# EasyEDA Pro project 桌面排烟扇.eprj

# Schematic Schematic1
Board Name: Board1; Create Date: 2025-06-08; Page Name: P1; Project Name: 桌面排烟扇; Schematic Name: Schematic1; Update Date: 2025-06-08; Add into BOM: yes; Company: 嘉立创EDA; Convert to PCB: yes; Page Size: A4; Version: V1.0
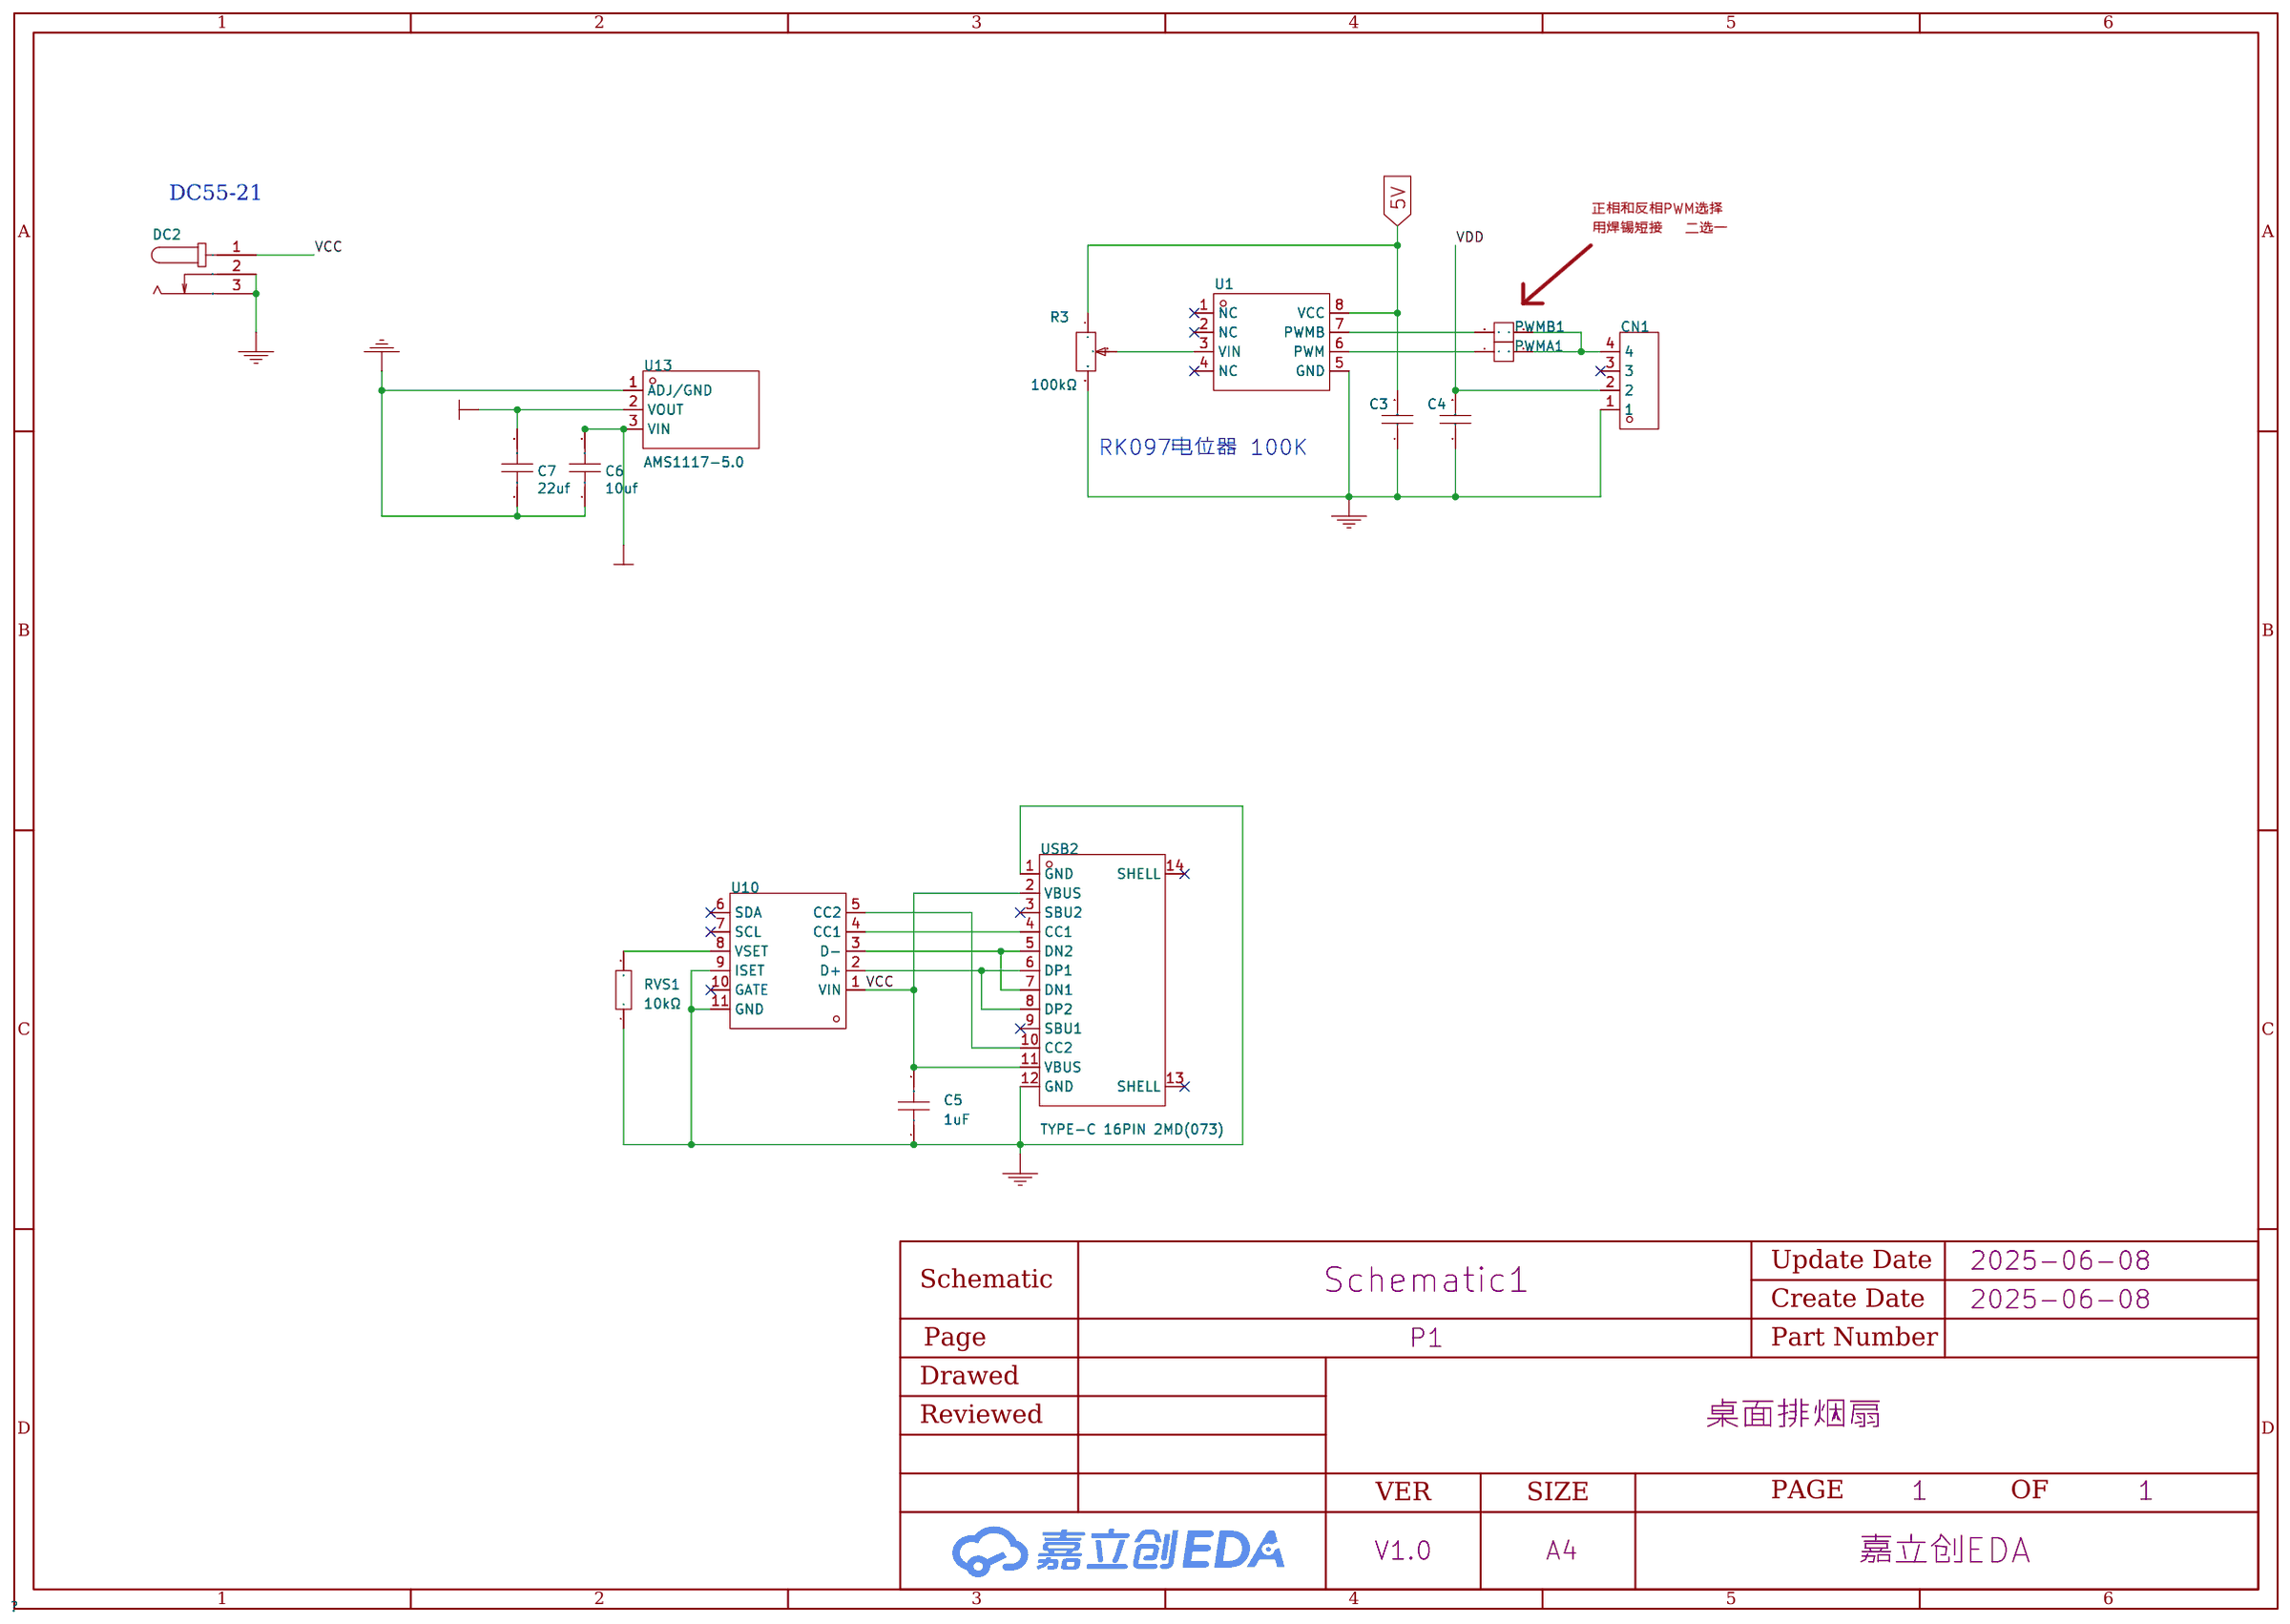
[diagram p0: schematic sheet]

## Parts
C3  10uF  [C0603]
C4  10uF  [C0603]
C5  1uF  [C0603]
C6  10uf  [C0603]
C7  22uf  [C0603]
CN1  KF2510-4AGW-GW  [CONN-TH_4P-P2.54_CAX_KF2510-4AGW-GW]
DC2  -  [DC-IN-TH_KH-DC-005-2.5]
PWMA1  -  [cs]
PWMB1  -  [cs]
R3  100kΩ  [res-adj-th_rk097111080j]
RVS1  10kΩ  [R0603]
U1  GP9101-F20K-L2H1-SW  [SOP-8_L5.0-W3.9-P1.27-LS6.0-BL]
U10  HUSB238-002D  [TDFN-10_L3.0-W3.0-P0.50-BL-EP]
U13  AMS1117-5.0  [SOT-89-3_L4.5-W2.5-P1.50-LS4.2-BR]
USB2  TYPE-C 16PIN 2MD(073)  [USB-C-SMD_TYPE-C-6PIN-2MD-073]

## Library data of the parts
C3 C4 = GRM188R6YA106MA73D: 容值:10uF;精度:±20%;额定电压:35V;材质(温度系数):-;; LCSC Part Name: 10uF ±20% 35V; Supplier Part: C194427; Manufacturer: muRata(村田); Supplier Footprint: 0603; JLCPCB Part Class: Extended Part; Datasheet: https://atta.szlcsc.com/upload/public/pdf/source/20210128/C194427_FCA3640823207DDB58700A82F1A19B5F.pdf; Supplier: LCSC; Tolerance: ±20%; Voltage Rated: 35V
C5 = CL10A105KL8NNNC: 容值:1uF;精度:±10%;额定电压:35V;材质(温度系数):-;; LCSC Part Name: 1uF ±10% 35V; Supplier Part: C478859; Manufacturer: SAMSUNG(三星); Supplier Footprint: 0603; JLCPCB Part Class: 扩展库; Datasheet: https://atta.szlcsc.com/upload/public/pdf/source/20200102/C478859_0EBF0387113597ECF4C91C52A34CAFD4.pdf; Supplier: LCSC; Tolerance: ±10%; Voltage Rated: 35V
C6 = 10uf
C7 = 22uf
CN1 = KF2510-4AGW-GW: 参考系列:-;间距:2.54mm;插针结构:1x4P;排数:1;每排PIN数:4;行距:-;公母:公型插针;安装方式:弯插;额定电流:3A;工作温度范围:-25℃~+85℃;; LCSC Part Name: 2.54mm 1x4P 弯插; Supplier Part: C722747; Manufacturer: CAX(创都); Supplier Footprint: 弯插,P=2.54mm; JLCPCB Part Class: 扩展库; Datasheet: https://atta.szlcsc.com/upload/public/pdf/source/20200903/C722719_349FB032BA69A16250788D6DAC1BEE3A.pdf; Supplier: LCSC; Pitch: 2.54mm; Pins Structure: 1x4P; Number of Rows: 1; Number of PINs Per Row: 4; Gender: 公型插针; Mounting Style: 弯插; Current Rating (Max): 3A; Operating Temperature Range: -25℃~+85℃
DC2 = KH-DC-005-2.5: 连接器类型:DC电源插座;安装方式:弯插;触点内径:-;触点外径:6.4mm;额定电流:1A;额定电压:30V;工作温度范围:-25~+70;; LCSC Part Name: DC电源插座 外径:6.4mm; Supplier Part: C2847170; Manufacturer: kinghelm(金航标); Supplier Footprint: 插件; JLCPCB Part Class: Extended Part; Datasheet: https://atta.szlcsc.com/upload/public/pdf/source/20210716/C2847170_7F0110A0BEDEE81C68B76DF87AC8DA16.pdf; Supplier: LCSC; Connector Type: DC电源插座; Mounting Style: 弯插; Outside Contact Diameter: 6.4mm; Current Rating (Max): 1A; Voltage Rating (Max): 30V; Operating Temperature Range: -25~+70
PWMA1 PWMB1 = cs
R3 = RK097111080J: Resistance: 100k; Datasheet: https://item.szlcsc.com/datasheet/RK097111080J/98652.html?spm=sc.gbn.xds.a___sc.gbn.hd.ss&lcsc_vid=QVgIA1xXQVVcVlVeQlVdUl0EElkKA1EEElNfVVIFRlkxVlNSTlJaUFNTRFZXVjsOAxUeFF5JWBIBSRccGwIdBEoFGAxBAAgJFQACSQwSGg0%3D
RVS1 = 0603WAF1002T5E: 电阻类型:厚膜电阻;阻值:10kΩ;精度:±1%;功率:100mW;; LCSC Part Name: 厚膜电阻 10kΩ ±1% 100mW; Supplier Part: C25804; Manufacturer: UNI-ROYAL(厚声); Supplier Footprint: 0603; JLCPCB Part Class: 基础库; Datasheet: https://atta.szlcsc.com/upload/public/pdf/source/20200306/C422600_1E6D84923E4A46A82E41ADD87F860B5C.pdf; Supplier: LCSC; Type: 厚膜电阻; Tolerance: ±1%; Power(Watts): 100mW; Temperature Coefficient: ±100ppm/℃; Overload Voltage (Max): 75V; Operating Temperature Range: -55℃~+155℃
U1 = GP9101-F20K-L2H1-SW: GP9101 0-VCC转PWM 20KHz L2H1; LCSC Part Name: 模拟信号转PWM信号; Supplier Part: C2837710; Manufacturer: Guestgood(客益); Supplier Footprint: SOP8; JLCPCB Part Class: 扩展库; Datasheet: https://atta.szlcsc.com/upload/public/pdf/source/20210611/C2837710_B55E2012AD9BA99B0BFF632E52DE3359.pdf; Supplier: LCSC
U10 = HUSB238-002D: Supplier Part: C2765038; JLCPCB Part Class: 扩展库; Supplier: LCSC
U13 = AMS1117-5.0: Supplier Part: C880753; Manufacturer: Slkor(萨科微); Supplier Footprint: SOT-89; JLCPCB Part Class: Extended Part; Datasheet: https://atta.szlcsc.com/upload/public/pdf/source/20190906/C426566_95BE246DE70C248781207323626ADB09.pdf; Supplier: LCSC
USB2 = TYPE-C 16PIN 2MD(073): 连接器类型:Type-C;标准:USB 3.1;公母:母;安装方式:卧贴;触点数量:16P;端口数量:1;额定电流 - 电源:5A;工作温度范围:-25℃~+85℃;; LCSC Part Name: Type-C 母 卧贴; Supplier Part: C2765186; Manufacturer: SHOU HAN(首韩); Supplier Footprint: SMD; JLCPCB Part Class: Extended Part; Datasheet: https://atta.szlcsc.com/upload/public/pdf/source/20211123/39B17C16241EAC15C5E277BDA434118E.pdf; Supplier: LCSC; Connector Type: Type-C; Standard: USB 3.1; Gender: 母; Mounting Style: 卧贴; Number of Contacts: 16P; Number of Ports: 1; Current Rating - Power (Max): 5A; Operating Temperature Range: -25℃~+85℃; Rated Voltage (Max): 5V; Connect-Disconnect Life: 5千次; Core Colour: 黑色

## Nets
5V: C3.2 C7.2 R3.1 U1.8(VCC) U13.2(VOUT)
GND: C3.1 C4.1 C5.1 C6.1 C7.1 CN1.1 DC2.2 DC2.3 R3.3 RVS1.1 U1.5(GND) U10.9(ISET) U10.11(GND) U13.1(ADJ/GND) USB2.1(GND) USB2.12(GND)
VCC: C5.2 DC2.1 U10.1(VIN) USB2.2(VBUS) USB2.11(VBUS)
VDD: C4.2 C6.2 CN1.2 U13.3(VIN)
$1N740: R3.2 U1.3(VIN)
$1N747: RVS1.2 U10.8(VSET)
$1N750: PWMA1.1 U1.6(PWM)
$1N751: PWMB1.1 U1.7(PWMB)
$1N752: CN1.4 PWMA1.2 PWMB1.2
$1N1674: U10.4(CC1) USB2.4(CC1)
$1N1681: U10.2(D+) USB2.6(DP1) USB2.8(DP2)
$1N1699: U10.3(D-) USB2.5(DN2) USB2.7(DN1)
$1N1759: U10.5(CC2) USB2.10(CC2)

Not connected (* = marked no-connect by the designer): CN1 3*; U1 1(NC)* 2(NC)* 4(NC)*; U10 6(SDA)* 7(SCL)* 10(GATE)*; USB2 3(SBU2)* 9(SBU1)* 13(SHELL)* 14(SHELL)*

## Notes on the sheet
- DC55-21
- 正相和反相PWM选择
- 用焊锡短接   二选一
- RK097电位器 100K

# Schematic Schematic2
Board Name: NE55; Create Date: 2025-09-05; Page Name: P1; Project Name: 桌面排烟扇; Schematic Name: Schematic2; Update Date: 2025-09-05; Add into BOM: yes; Company: 嘉立创EDA; Convert to PCB: yes; Page Size: A4; Version: V1.0
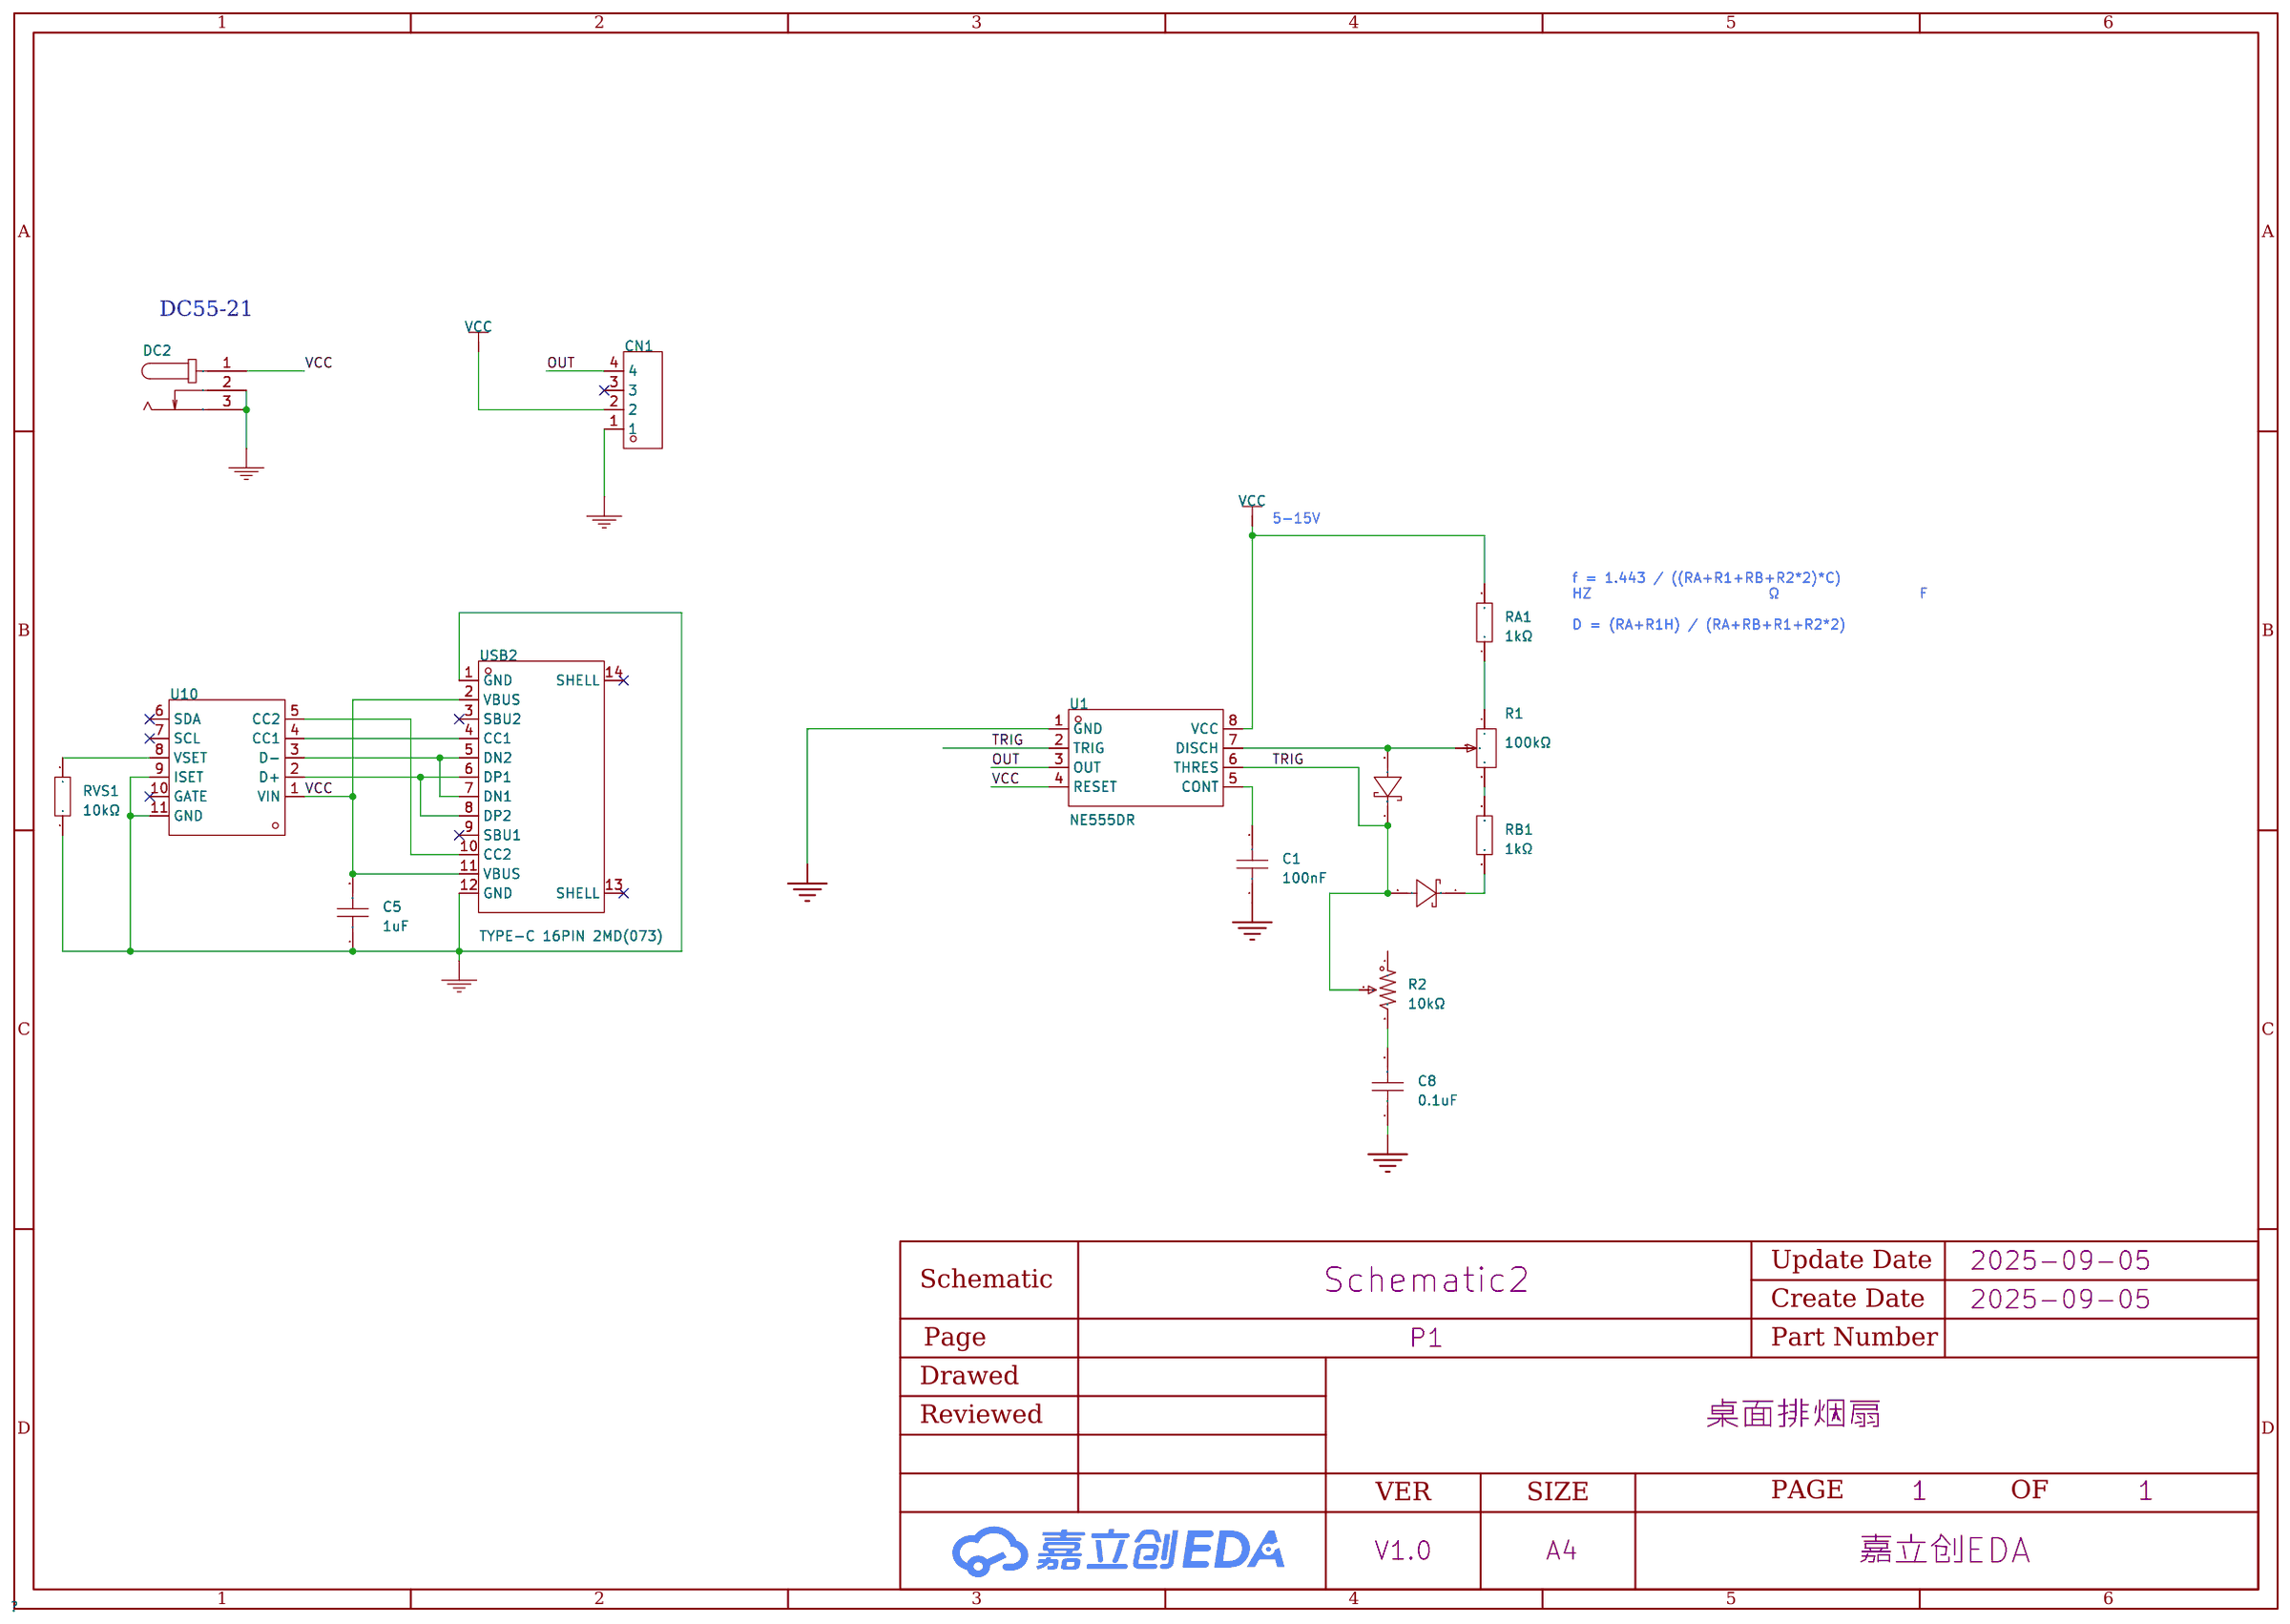
[diagram p1: schematic sheet]

## Parts
C1  100nF  [C0603]
C5  1uF  [C0603]
C8  0.1uF  [C0603]
CN1  KF2510-4AGW-GW  [CONN-TH_4P-P2.54_CAX_KF2510-4AGW-GW]
DC2  -  [DC-IN-TH_KH-DC-005-2.5]
R1  100kΩ  [res-adj-th_rk097111080j]
R2  10kΩ  [RES-ADJ-TH_3P-L10.0-W10.0-P2.50-L]
RA1  1kΩ  [R0603]
RB1  1kΩ  [R0603]
RVS1  10kΩ  [R0603]
U1  NE555DR  [SOP-8_L5.0-W4.0-P1.27-LS6.0-BL]
U2  MBR0520W B2  [SOD-123_L2.7-W1.7-LS3.8-RD]
U3  MBR0520W B2  [SOD-123_L2.7-W1.7-LS3.8-RD]
U10  HUSB238-002D  [TDFN-10_L3.0-W3.0-P0.50-BL-EP]
USB2  TYPE-C 16PIN 2MD(073)  [USB-C-SMD_TYPE-C-6PIN-2MD-073]

## Library data of the parts
C1 = CC0603KRX7R9BB104: 容值:100nF;精度:±10%;额定电压:50V;温度系数:X7R;; LCSC Part Name: 100nF ±10% 50V; Supplier Part: C14663; Manufacturer: YAGEO(国巨); Supplier Footprint: 0603; JLCPCB Part Class: Basic Part; Datasheet: https://atta.szlcsc.com/upload/public/pdf/source/20180910/C282072_33301C7F631E79921B82A8DAC6BCC5B3.pdf; Supplier: LCSC; Tolerance: ±10%; Voltage Rating: 50V; Temperature Coefficient: X7R
C5 = CL10A105KL8NNNC: 容值:1uF;精度:±10%;额定电压:35V;材质(温度系数):-;; LCSC Part Name: 1uF ±10% 35V; Supplier Part: C478859; Manufacturer: SAMSUNG(三星); Supplier Footprint: 0603; JLCPCB Part Class: 扩展库; Datasheet: https://atta.szlcsc.com/upload/public/pdf/source/20200102/C478859_0EBF0387113597ECF4C91C52A34CAFD4.pdf; Supplier: LCSC; Tolerance: ±10%; Voltage Rated: 35V
C8 = CL10A105KB8NNNC: 容值:1uF;精度:±10%;额定电压:50V;材质(温度系数):X5R;; LCSC Part Name: 1uF ±10% 50V; Supplier Part: C15849; Manufacturer: SAMSUNG(三星); Supplier Footprint: 0603; JLCPCB Part Class: Basic Part; Datasheet: https://atta.szlcsc.com/upload/public/pdf/source/20160218/1457707763339.pdf; Supplier: LCSC; Tolerance: ±10%; Voltage Rated: 50V; Temperature Coefficient: X5R
CN1 = KF2510-4AGW-GW: 参考系列:-;间距:2.54mm;插针结构:1x4P;排数:1;每排PIN数:4;行距:-;公母:公型插针;安装方式:弯插;额定电流:3A;工作温度范围:-25℃~+85℃;; LCSC Part Name: 2.54mm 1x4P 弯插; Supplier Part: C722747; Manufacturer: CAX(创都); Supplier Footprint: 弯插,P=2.54mm; JLCPCB Part Class: 扩展库; Datasheet: https://atta.szlcsc.com/upload/public/pdf/source/20200903/C722719_349FB032BA69A16250788D6DAC1BEE3A.pdf; Supplier: LCSC; Pitch: 2.54mm; Pins Structure: 1x4P; Number of Rows: 1; Number of PINs Per Row: 4; Gender: 公型插针; Mounting Style: 弯插; Current Rating (Max): 3A; Operating Temperature Range: -25℃~+85℃
DC2 = KH-DC-005-2.5: 连接器类型:DC电源插座;安装方式:弯插;触点内径:-;触点外径:6.4mm;额定电流:1A;额定电压:30V;工作温度范围:-25~+70;; LCSC Part Name: DC电源插座 外径:6.4mm; Supplier Part: C2847170; Manufacturer: kinghelm(金航标); Supplier Footprint: 插件; JLCPCB Part Class: Extended Part; Datasheet: https://atta.szlcsc.com/upload/public/pdf/source/20210716/C2847170_7F0110A0BEDEE81C68B76DF87AC8DA16.pdf; Supplier: LCSC; Connector Type: DC电源插座; Mounting Style: 弯插; Outside Contact Diameter: 6.4mm; Current Rating (Max): 1A; Voltage Rating (Max): 30V; Operating Temperature Range: -25~+70
R1 = RK097111080J: Resistance: 100k; Datasheet: https://item.szlcsc.com/datasheet/RK097111080J/98652.html?spm=sc.gbn.xds.a___sc.gbn.hd.ss&lcsc_vid=QVgIA1xXQVVcVlVeQlVdUl0EElkKA1EEElNfVVIFRlkxVlNSTlJaUFNTRFZXVjsOAxUeFF5JWBIBSRccGwIdBEoFGAxBAAgJFQACSQwSGg0%3D
R2 = 3296W-1-103: 阻值:10kΩ;精度:±10%;; LCSC Part Name: 10kΩ ±10%; Supplier Part: C118954; Manufacturer: BOCHEN(博晨); Supplier Footprint: 插件; JLCPCB Part Class: 扩展库; Datasheet: https://atta.szlcsc.com/upload/public/pdf/source/20171114/C118954_15106326646611117443.pdf; Supplier: LCSC; Tolerance: ±10%
RA1 RB1 = 0603WAF1002T5E: 电阻类型:厚膜电阻;阻值:10kΩ;精度:±1%;功率:100mW;; LCSC Part Name: 厚膜电阻 10kΩ ±1% 100mW; Supplier Part: C25804; Manufacturer: UNI-ROYAL(厚声); Supplier Footprint: 0603; JLCPCB Part Class: 基础库; Datasheet: https://atta.szlcsc.com/upload/public/pdf/source/20200306/C422600_1E6D84923E4A46A82E41ADD87F860B5C.pdf; Supplier: LCSC; Type: 厚膜电阻; Tolerance: ±1%; Power(Watts): 100mW; Temperature Coefficient: ±100ppm/℃; Overload Voltage (Max): 75V; Operating Temperature Range: -55℃~+155℃; Voltage-Supply(Max): 75V; Operating Temperature: -55℃~+155℃
RVS1 = 0603WAF1002T5E: 电阻类型:厚膜电阻;阻值:10kΩ;精度:±1%;功率:100mW;; LCSC Part Name: 厚膜电阻 10kΩ ±1% 100mW; Supplier Part: C25804; Manufacturer: UNI-ROYAL(厚声); Supplier Footprint: 0603; JLCPCB Part Class: 基础库; Datasheet: https://atta.szlcsc.com/upload/public/pdf/source/20200306/C422600_1E6D84923E4A46A82E41ADD87F860B5C.pdf; Supplier: LCSC; Type: 厚膜电阻; Tolerance: ±1%; Power(Watts): 100mW; Temperature Coefficient: ±100ppm/℃; Overload Voltage (Max): 75V; Operating Temperature Range: -55℃~+155℃
U1 = NE555DR: Supplier Part: C695838; Manufacturer: UMW(友台半导体); Supplier Footprint: SOP-8; JLCPCB Part Class: 扩展库; Datasheet: https://atta.szlcsc.com/upload/public/pdf/source/20231109/10F1BB7F0C3DC760A85BC3699079301C.pdf; Supplier: LCSC
U2 U3 = MBR0520W B2: LCSC Part Name: 电压:20V 电流:500mA; Supplier Part: C2965564; Manufacturer: Slkor(萨科微); Supplier Footprint: SOD-123; JLCPCB Part Class: Extended Part; Datasheet: https://atta.szlcsc.com/upload/public/pdf/source/20220121/DA2582E478F99E574518FC7550548B59.pdf; Supplier: LCSC; Diode Configuration: 独立式; Forward Voltage (Vf@If): 390mV@0.5A; Reverse Voltage (Vr): 20V; Rectified Current: 500mA; Reverse Leakage Current (Ir): 250uA@20V
U10 = HUSB238-002D: Supplier Part: C2765038; JLCPCB Part Class: 扩展库; Supplier: LCSC
USB2 = TYPE-C 16PIN 2MD(073): 连接器类型:Type-C;标准:USB 3.1;公母:母;安装方式:卧贴;触点数量:16P;端口数量:1;额定电流 - 电源:5A;工作温度范围:-25℃~+85℃;; LCSC Part Name: Type-C 母 卧贴; Supplier Part: C2765186; Manufacturer: SHOU HAN(首韩); Supplier Footprint: SMD; JLCPCB Part Class: Extended Part; Datasheet: https://atta.szlcsc.com/upload/public/pdf/source/20211123/39B17C16241EAC15C5E277BDA434118E.pdf; Supplier: LCSC; Connector Type: Type-C; Standard: USB 3.1; Gender: 母; Mounting Style: 卧贴; Number of Contacts: 16P; Number of Ports: 1; Current Rating - Power (Max): 5A; Operating Temperature Range: -25℃~+85℃; Rated Voltage (Max): 5V; Connect-Disconnect Life: 5千次; Core Colour: 黑色

## Nets
GND: C1.1 C5.1 C8.1 CN1.1 DC2.2 DC2.3 RVS1.1 U1.1(GND) U10.9(ISET) U10.11(GND) USB2.1(GND) USB2.12(GND)
VCC: C5.2 CN1.2 DC2.1 RA1.2 U1.4(RESET) U1.8(VCC) U10.1(VIN) USB2.2(VBUS) USB2.11(VBUS)
OUT: CN1.4 U1.3(OUT)
TRIG: R2.2 U1.2(TRIG) U1.6(THRES) U2.1(C) U3.2(A)
$1N725: RVS1.2 U10.8(VSET)
$1N735: U10.4(CC1) USB2.4(CC1)
$1N736: U10.2(D+) USB2.6(DP1) USB2.8(DP2)
$1N737: U10.3(D-) USB2.5(DN2) USB2.7(DN1)
$1N738: U10.5(CC2) USB2.10(CC2)
$1N1179: C1.2 U1.5(CONT)
$1N1184: R1.2 U1.7(DISCH) U2.2(A)
$1N1185: R1.1 RA1.1
$1N1186: RB1.1 U3.1(C)
$1N1187: R1.3 RB1.2
$1N1196: C8.2 R2.3

Not connected (* = marked no-connect by the designer): CN1 3*; R2 1; U10 6(SDA)* 7(SCL)* 10(GATE)*; USB2 3(SBU2)* 9(SBU1)* 13(SHELL)* 14(SHELL)*

## Notes on the sheet
- DC55-21
- 5-15V
- f = 1.443 / ((RA+R1+RB+R2*2)*C)
  HZ                        Ω                   F
  D = (RA+R1H) / (RA+RB+R1+R2*2)

# Board PCB1
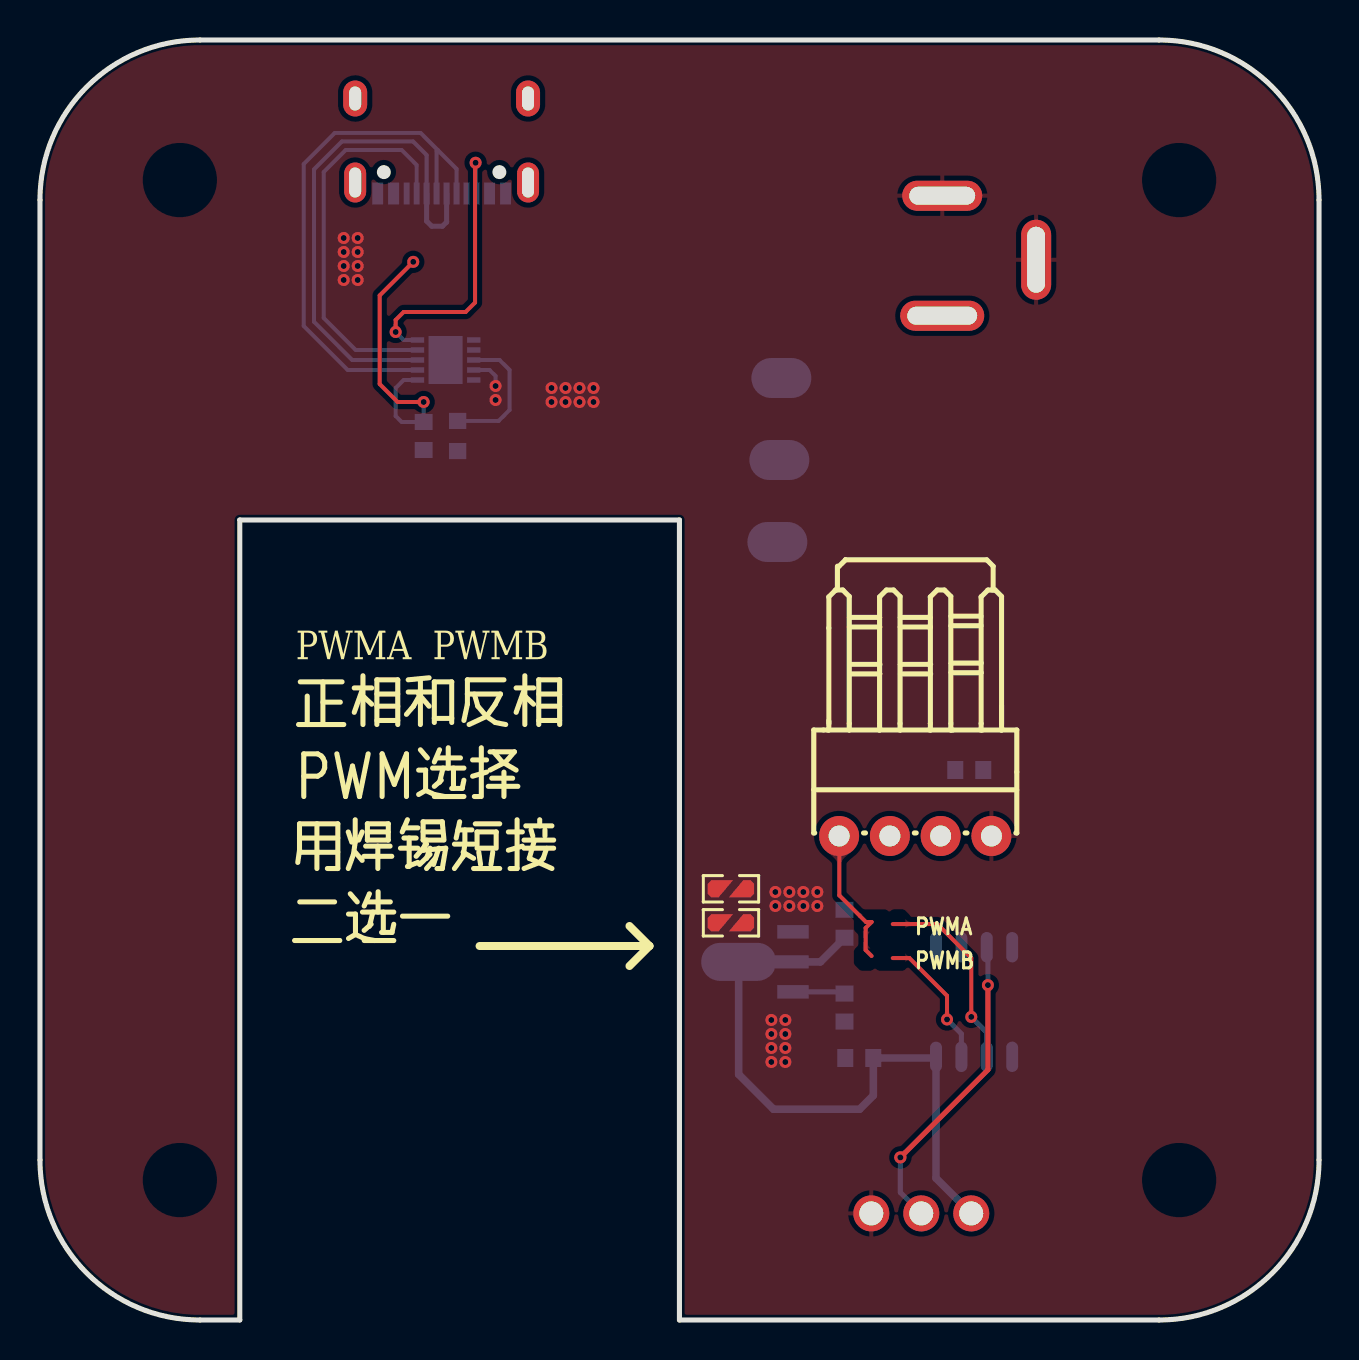
[diagram p2: board, top side]
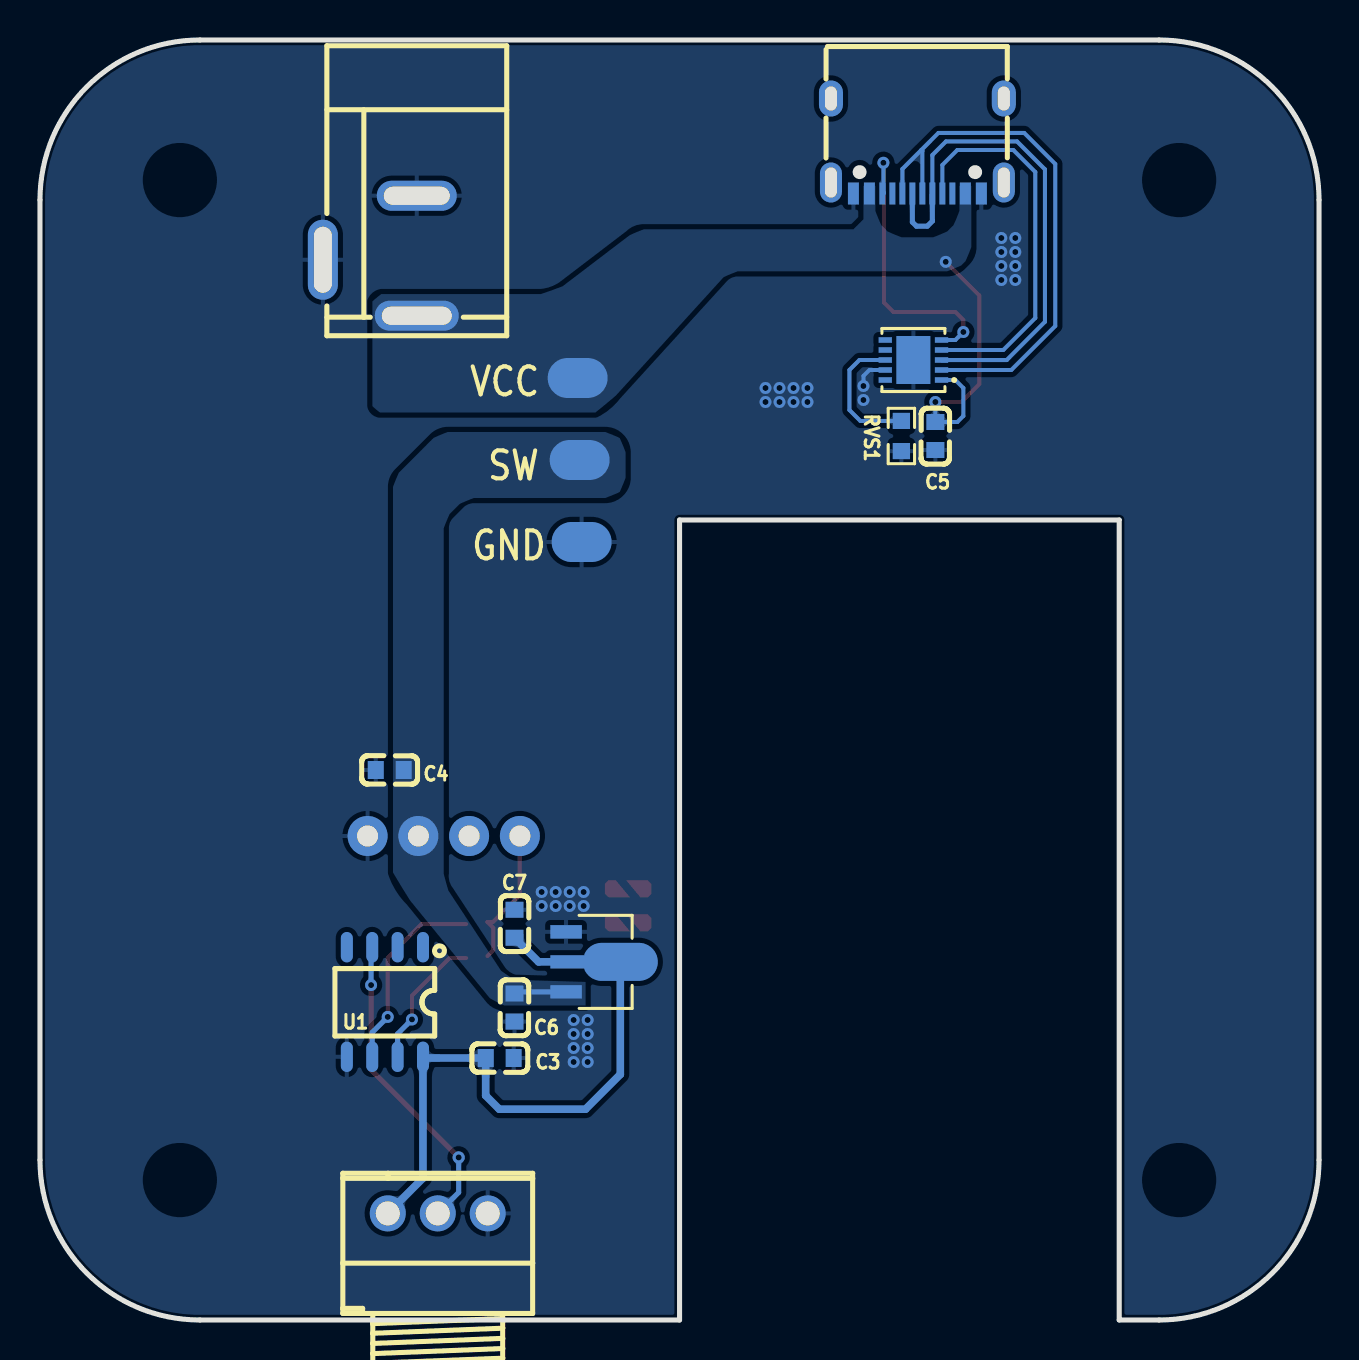
[diagram p3: board, bottom side, seen from below]

Outline 64 x 64 mm; copper layers: Top Layer, Bottom Layer. Coordinates in mm from the lower left corner of the outline.
Outline path: 0,56 arc(2.34,61.66) 8,64 56,64 arc(61.66,61.66) 64,56 64,8 arc(61.66,2.34) 56,0 32,0 32,40 10,40 10,0 8,0 arc(2.34,2.34) 0,8 0,56
Stack: Top Layer 0.035mm / Dielectric1 1.51mm FR4 er 4.5 / Bottom Layer 0.035mm

## Design rules (mm)
template: JLCPCB Capability(Two Layers Board)
spacing copperThickness1oz (default): track to track 0.102, other pairs 0.152 to 0.3
spacing copperThickness2oz: track to track 0.203, other pairs 0.152 to 0.3
track width copperThickness1oz (default): min 0.127, default 0.254, max 2.54
track width copperThickness2oz: min 0.203, default 0.254, max 2.54
differential pair differentialPair (default): width min 0.127, default 0.254, max 2.54; gap min 0.152, default 0.152
via viaSize (default): diameter min 0.5, default 0.61, max 10; hole min 0.3, default 0.305, max 6.3

## Placement (name value [footprint] x y rotation side)
C3  10uF  [C0603]  41 13.1 0 bottom
C4  10uF  [C0603]  46.5 27.5 180 bottom
C5  1uF  [C0603]  19.2 44.2 90 bottom
C6  10uf  [C0603]  40.26 15.62 90 bottom
C7  22uf  [C0603]  40.26 19.81 270 bottom
CN1  KF2510-4AGW-GW  [CONN-TH_4P-P2.54_CAX_KF2510-4AGW-GW]  43.8 24.2 180 top
DC2  -  [DC-IN-TH_KH-DC-005-2.5]  47.49 53.21 270 bottom
NOREF  -  [Pad_e192]  36.9 38.9 0 top
NOREF#2  -  [Pad_e194]  37.1 47.1 0 top
NOREF#3  -  [Pad_e193]  37 43 0 top
PWMA1  -  [cs]  42.14 19.85 180 top
PWMB1  -  [cs]  42.14 18.15 180 top
R3  100kΩ  [res-adj-th_rk097111080j]  44.1 5.33 180 bottom
RVS1  10kΩ  [R0603]  20.9 44.2 90 bottom
U1  GP9101-F20K-L2H1-SW  [SOP-8_L5.0-W3.9-P1.27-LS6.0-BL]  46.74 15.9 0 bottom
U10  HUSB238-002D  [TDFN-10_L3.0-W3.0-P0.50-BL-EP]  20.3 48 90 bottom
U13  AMS1117-5.0  [SOT-89-3_L4.5-W2.5-P1.50-LS4.2-BR]  36.32 17.91 0 bottom
USB2  TYPE-C 16PIN 2MD(073)  [USB-C-SMD_TYPE-C-6PIN-2MD-073]  20.1 58.7 0 bottom

## Footprints (pads in the part's own frame, mm; a bottom-side part is the same pattern mirrored in y, then rotated)
C0603
  rect 0.8x0.9 smd: 1(-0.7,0) 2(0.7,0)
CONN-TH_4P-P2.54_CAX_KF2510-4AGW-GW
  round 2 hole 1.05: 1(-3.81,0) 2(-1.27,0) 3(1.27,0) 4(3.81,0)
cs
  custom 1.26x0.86 smd: 1(7.04,-1.66) 2(8.1,-1.764)
DC-IN-TH_KH-DC-005-2.5
  oval 1.501x4.201 hole 0.899x3.5: 1(2.999,2.349)
  oval 1.501x4 hole 0.899x3.3: 2(-2.999,2.349)
  oval 4x1.501 hole 3.3x0.899: 3(0.201,-2.349)
Pad_e192
  oval 3x2 smd far side: 1(0,0)
Pad_e193
  oval 3x2 smd far side: 1(0,0)
Pad_e194
  oval 3x2 smd far side: 1(0,0)
R0603
  rect 0.806x0.864 smd: 1(-0.753,0) 2(0.753,0)
res-adj-th_rk097111080j
  round 1.8 hole 1.2: 1(-2.5,0) 2(0,0) 3(2.5,0)
SOP-8_L5.0-W3.9-P1.27-LS6.0-BL
  oval 0.6x1.52 smd: 1(-1.905,-2.74) 2(-0.635,-2.74) 3(0.635,-2.74) 4(1.905,-2.74) 5(1.905,2.74) 6(0.635,2.74) 7(-0.635,2.74) 8(-1.905,2.74)
SOT-89-3_L4.5-W2.5-P1.50-LS4.2-BR
  rect 1.575x0.672 smd: 1(1.356,-1.5) 3(1.356,1.5)
  custom 5.377x1.9 smd: 2(-1.356,0)
TDFN-10_L3.0-W3.0-P0.50-BL-EP
  rect 0.28x0.665 smd: 1(-1,-1.407) 2(-0.5,-1.407) 3(0,-1.407) 4(0.5,-1.407) 5(1,-1.407) 6(1,1.407) 7(0.5,1.407) 8(0,1.407) 9(-0.5,1.407) 10(-1,1.407)
  rect 2.4x1.7 smd: 11(0,0)
USB-C-SMD_TYPE-C-6PIN-2MD-073
  rect 0.55x1.1 smd: 1(-3.2,2.375) 2(-2.4,2.375) 11(2.4,2.375) 12(3.2,2.375)
  rect 0.3x1.1 smd: 3(-1.75,2.375) 4(-1.25,2.375) 5(-0.75,2.375) 6(-0.25,2.375) 7(0.25,2.375) 8(0.75,2.375) 9(1.25,2.375) 10(1.75,2.375)
  oval 1.2x1.8 hole 0.6x1.2: 13(-4.325,-2.375) 14(4.325,-2.375)
  oval 1.1x2 hole 0.6x1.5: 13(-4.325,1.825) 14(4.325,1.825)

## Nets
5V: C3.2 C7.2 R3.1 U1.8 U13.2
GND: C3.1 C4.1 C5.1 C6.1 C7.1 CN1.1 DC2.2 DC2.3 NOREF.1 R3.3 RVS1.1 U1.5 U10.9 U10.11 U13.1 USB2.1 USB2.12
VCC: C5.2 DC2.1 NOREF#2.1 U10.1 USB2.2 USB2.11
VDD: C4.2 C6.2 CN1.2 NOREF#3.1 U13.3
$1N740: R3.2 U1.3
$1N747: RVS1.2 U10.8
$1N750: PWMA1.1 U1.6
$1N751: PWMB1.1 U1.7
$1N752: CN1.4 PWMA1.2 PWMB1.2
$1N1674: U10.4 USB2.4
$1N1681: U10.2 USB2.6 USB2.8
$1N1699: U10.3 USB2.5 USB2.7
$1N1759: U10.5 USB2.10

Pads without a net: CN1 3; U1 1 2 4; U10 6 7 10; USB2 3 9 13 14

## Via types
v1: diameter 0.6, hole 0.3, Top Layer to Bottom Layer, 41 vias
v2: diameter 0.61, hole 0.305, Top Layer to Bottom Layer, 1 via

## Routing (per net, layer and track width the routed paths; a pad name or vN(x,y) marks a point on that pad's centre or on a via; arc(x,y) is an arc through that point)
5V: length 32.8
  Bottom Layer w0.381: R3.1 44.83,7.09 U1.8 44.77,13.1 C3.2 41.7,11.22 41.02,10.54 36.7,10.54 34.96,12.28 U13.2 39.05,17.91 C7.2
GND: length 1.7
  Bottom Layer w0.2: U10.9 22.5,47.5 22.8,47.2 v1(22.8,46.7)
  vias: v1(15.2,54.1) v1(15.2,53.4) v1(15.2,52.7) v1(15.2,52) v1(15.9,54.1) v1(15.9,53.4) v1(15.9,52.7) v1(15.9,52) v1(22.8,46) v1(25.6,46.6) v1(25.6,45.9) v1(26.3,46.6) v1(26.3,45.9) v1(27,46.6) v1(27,45.9) v1(27.7,46.6) v1(27.7,45.9) v1(36.6,15) v1(36.6,14.3) v1(36.6,13.6) v1(36.6,12.9) v1(36.8,21.4) v1(36.8,20.7) v1(37.3,15) v1(37.3,14.3) v1(37.3,13.6) v1(37.3,12.9) v1(37.5,21.4) v1(37.5,20.7) v1(38.2,21.4) v1(38.2,20.7) v1(38.9,21.4) v1(38.9,20.7)
VCC: length 14.6
  Top Layer w0.2: v1(19.2,45.9) 17.9,45.9 17,46.8 17,51.23 v1(18.68,52.91)
  Bottom Layer w0.2: v1(19.2,45.9) C5.2 18.1,44.9 17.8,45.2 17.8,46.6 18.2,47 U10.1
VDD: length 2.6
  Bottom Layer w0.254: U13.3 40.17,16.41 C6.2
$1N740: length 15.6
  Top Layer w0.254: v1(47.43,16.75) 47.43,12.51 v2(43.05,8.13)
  Bottom Layer w0.254: U1.3 47.43,18.58 v1(47.43,16.75) ; v2(43.05,8.13) 43.05,6.38 R3.2
$1N747: length 6.8
  Bottom Layer w0.2: RVS1.2 22.95,44.95 23.5,45.5 23.5,47.5 23,48 U10.8
$1N750: length 9.9
  Top Layer w0.2: 42.67,19.8 44.9,19.8 46.6,18.1 v1(46.6,15.15)
  Bottom Layer w0.254: v1(46.6,15.15) 47.37,14.38 U1.6
$1N751: length 6.8
  Top Layer w0.2: 42.67,18.1 43.5,18.1 45.39,16.21 v1(45.39,15.03)
  Bottom Layer w0.254: U1.7 46.11,14.31 v1(45.39,15.03)
$1N752: length 7.1
  Top Layer w0.2: CN1.4 40,24.19 40,21.23 41.33,19.9 41.61,19.9 41.31,19.6 41.31,18.5 41.61,18.2
$1N1674: length 19.4
  Bottom Layer w0.2: 18.85,56.43 18.85,57.75 18.1,58.5 15.3,58.5 14.2,57.4 14.2,50.1 15.8,48.5 U10.4
$1N1681: length 27.2
  Bottom Layer w0.2: 19.89,58.5 19.04,59.35 14.75,59.35 13.2,57.8 13.2,49.7 15.4,47.5 U10.2
  Bottom Layer w0.203: USB2.6 19.85,58.45 19.89,58.5 20.85,57.55 USB2.8
$1N1699: length 26
  Bottom Layer w0.203: USB2.5 19.35,58.25 18.67,58.93 15.11,58.93 13.71,57.53 13.71,49.91 15.62,48 U10.3
  Bottom Layer w0.254: USB2.7 20.35,54.89 20.14,54.69 19.6,54.69 19.35,54.94 USB2.5
$1N1759: length 14.8
  Top Layer w0.2: v1(17.8,49.4) 17.8,50 18.2,50.4 21.3,50.4 21.77,50.87 21.77,57.86
  Bottom Layer w0.2: v1(17.8,49.4) 18.2,49 U10.5
  Bottom Layer w0.203: 21.8,57.86 21.8,56.33 21.77,56.35
  vias: v1(21.8,57.86)

## Copper pours and planes (outline as drawn; the poured copper is in the pictures)
GND on Top Layer: -4.32,71.75 78.23,71.75 78.23,-24 -4.32,-24
GND on Bottom Layer: -2.92,67.44 68.45,67.44 68.45,-3.68 -2.92,-3.68
VCC on Bottom Layer: 17.4,56.71 47.37,56.71 47.37,45.37 17.4,45.37
VDD on Bottom Layer: 34.7,44.4 46.33,44.4 46.33,15.72 34.7,15.72

Small or netless copper shapes (teardrops, artwork), in the pictures only: 14 on Top Layer, 27 on Bottom Layer

## Text on the board
Bottom Silkscreen Layer: GND | SW | VCC
Top Silkscreen Layer: PWMA | PWMB | PWMA  PWMB | 用焊锡短接 | 二选一 | 正相和反相 | PWM选择

# Board PCB2
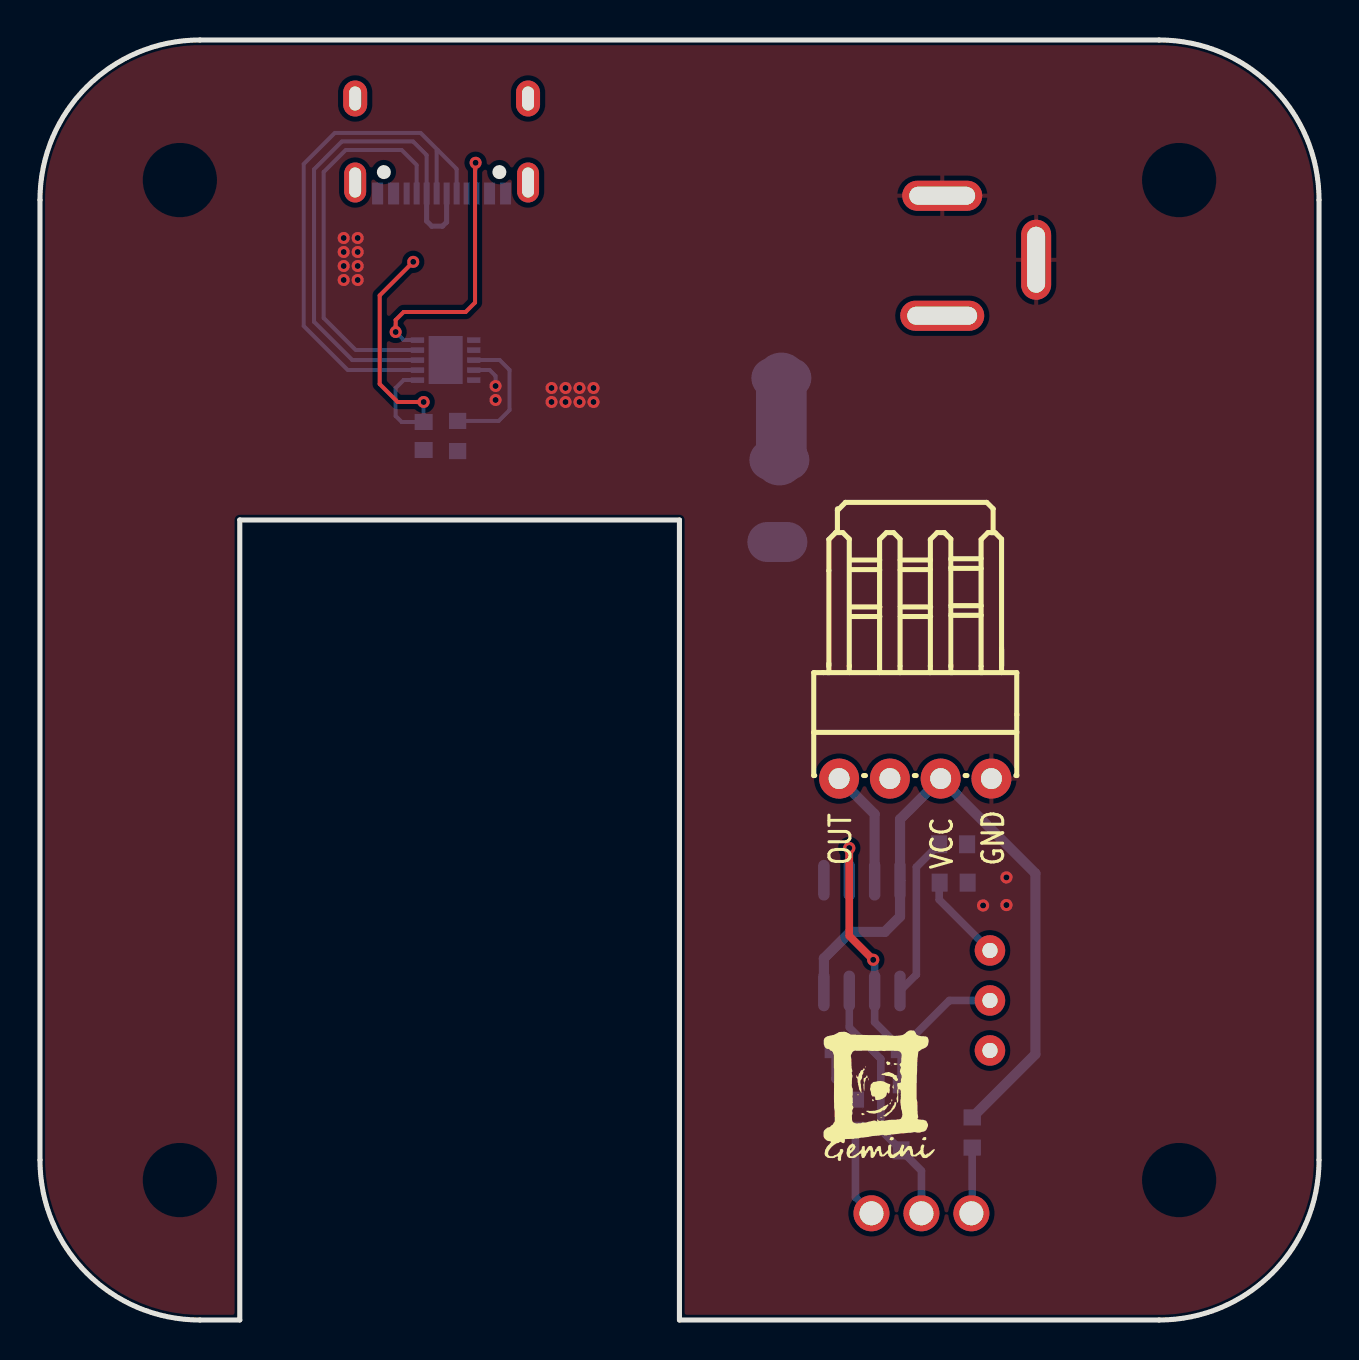
[diagram p4: board, top side]
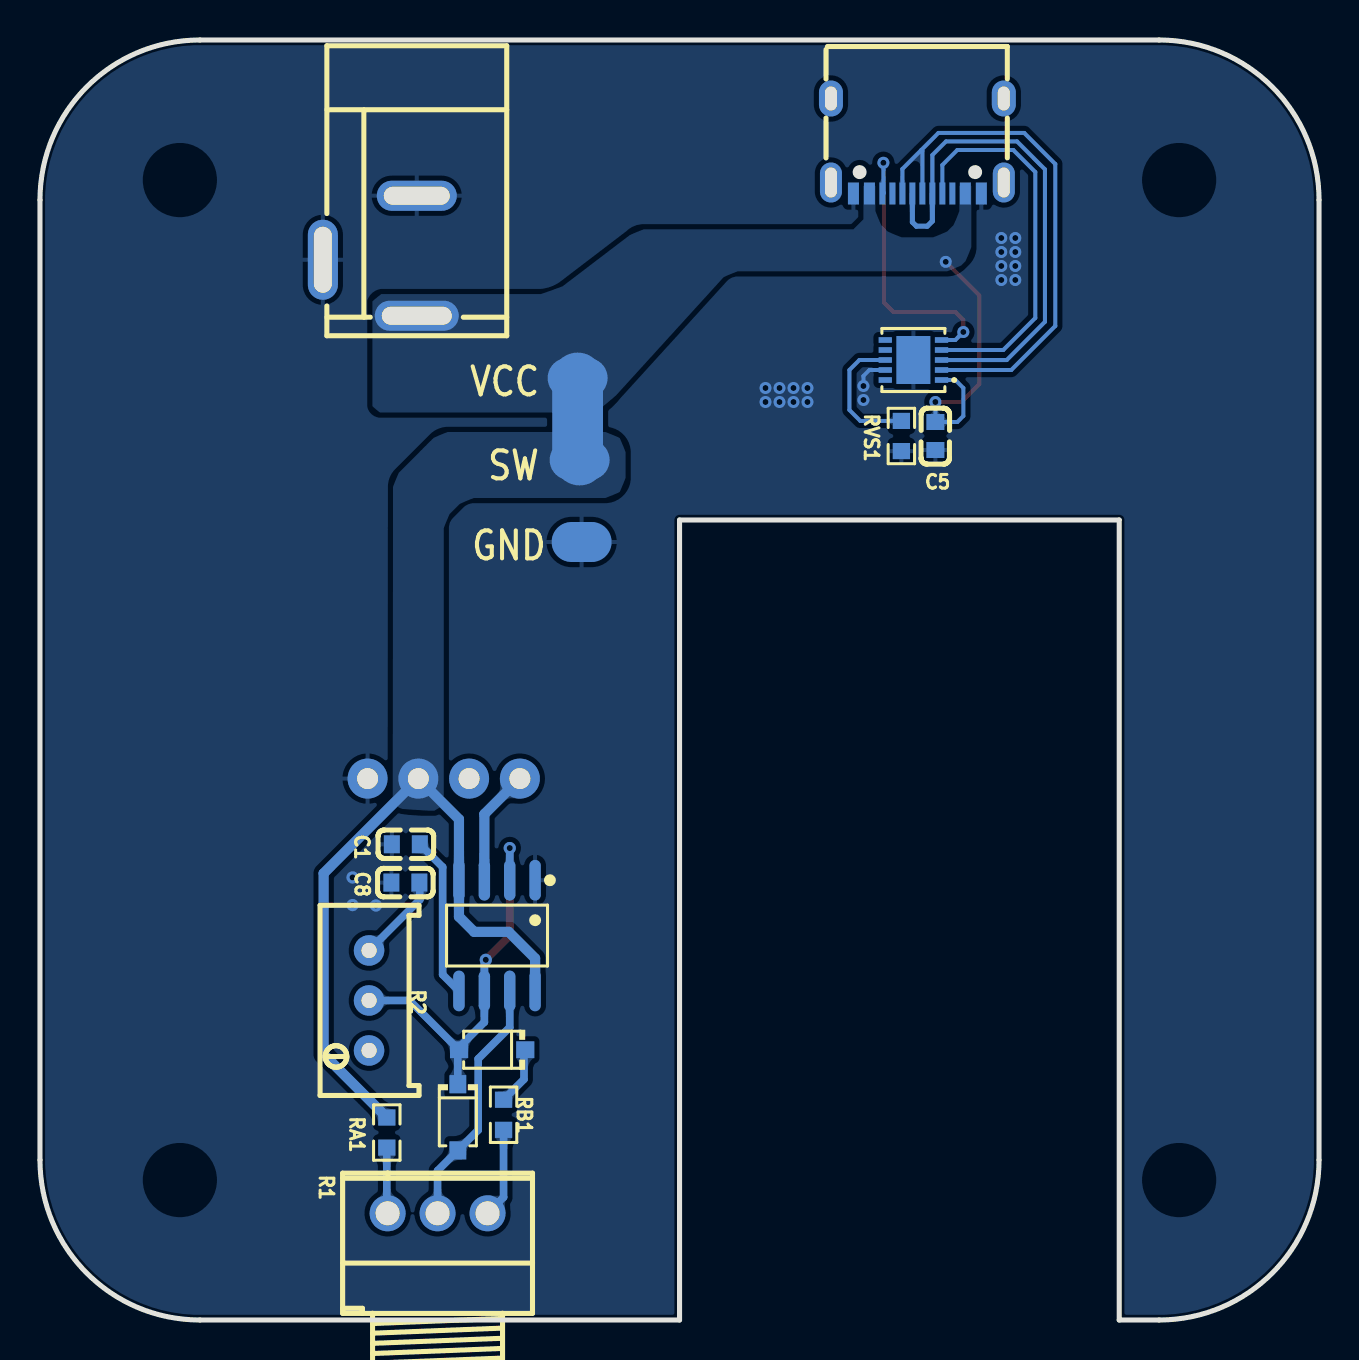
[diagram p5: board, bottom side, seen from below]

Outline 64 x 64 mm; copper layers: Top Layer, Bottom Layer. Coordinates in mm from the lower left corner of the outline.
Outline path: 0,56 arc(2.34,61.66) 8,64 56,64 arc(61.66,61.66) 64,56 64,8 arc(61.66,2.34) 56,0 32,0 32,40 10,40 10,0 8,0 arc(2.34,2.34) 0,8 0,56
Stack: Top Layer 0.035mm / Dielectric1 1.51mm FR4 er 4.5 / Bottom Layer 0.035mm

## Design rules (mm)
template: JLCPCB Capability(Two Layers Board)
spacing copperThickness1oz (default): track to track 0.102, other pairs 0.152 to 0.3
spacing copperThickness2oz: track to track 0.203, other pairs 0.152 to 0.3
track width copperThickness1oz (default): min 0.127, default 0.254, max 2.54
track width copperThickness2oz: min 0.203, default 0.254, max 2.54
differential pair differentialPair (default): width min 0.127, default 0.254, max 2.54; gap min 0.152, default 0.152
via viaSize (default): diameter min 0.5, default 0.61, max 10; hole min 0.3, default 0.305, max 6.3

## Placement (name value [footprint] x y rotation side)
C1  100nF  [C0603]  45.69 23.79 180 bottom
C5  1uF  [C0603]  19.2 44.2 90 bottom
C8  0.1uF  [C0603]  45.72 21.87 180 bottom
CN1  KF2510-4AGW-GW  [CONN-TH_4P-P2.54_CAX_KF2510-4AGW-GW]  43.8 27.07 180 top
DC2  -  [DC-IN-TH_KH-DC-005-2.5]  47.49 53.21 270 bottom
NOREF  -  [Pad_e932]  36.9 38.9 0 top
NOREF#2  -  [Pad_e934]  37.1 47.1 0 top
NOREF#3  -  [Pad_e933]  37 43 0 top
R1  100kΩ  [res-adj-th_rk097111080j]  44.11 5.34 180 bottom
R2  10kΩ  [RES-ADJ-TH_3P-L10.0-W10.0-P2.50-L]  47.53 15.98 90 bottom
RA1  1kΩ  [R0603]  46.64 9.37 90 bottom
RB1  1kΩ  [R0603]  40.8 10.26 270 bottom
RVS1  10kΩ  [R0603]  20.9 44.2 90 bottom
U1  NE555DR  [SOP-8_L5.0-W4.0-P1.27-LS6.0-BL]  41.13 19.22 0 bottom
U2  MBR0520W B2  [SOD-123_L2.7-W1.7-LS3.8-RD]  43.09 10.13 270 bottom
U3  MBR0520W B2  [SOD-123_L2.7-W1.7-LS3.8-RD]  41.37 13.51 0 bottom
U10  HUSB238-002D  [TDFN-10_L3.0-W3.0-P0.50-BL-EP]  20.3 48 90 bottom
USB2  TYPE-C 16PIN 2MD(073)  [USB-C-SMD_TYPE-C-6PIN-2MD-073]  20.1 58.7 0 bottom

## Footprints (pads in the part's own frame, mm; a bottom-side part is the same pattern mirrored in y, then rotated)
C0603
  rect 0.8x0.9 smd: 1(-0.7,0) 2(0.7,0)
CONN-TH_4P-P2.54_CAX_KF2510-4AGW-GW
  round 2 hole 1.05: 1(-3.81,0) 2(-1.27,0) 3(1.27,0) 4(3.81,0)
DC-IN-TH_KH-DC-005-2.5
  oval 1.501x4.201 hole 0.899x3.5: 1(2.999,2.349)
  oval 1.501x4 hole 0.899x3.3: 2(-2.999,2.349)
  oval 4x1.501 hole 3.3x0.899: 3(0.201,-2.349)
Pad_e932
  oval 3x2 smd far side: 1(0,0)
Pad_e933
  oval 3x2 smd far side: 1(0,0)
Pad_e934
  oval 3x2 smd far side: 1(0,0)
R0603
  rect 0.806x0.864 smd: 1(-0.753,0) 2(0.753,0)
RES-ADJ-TH_3P-L10.0-W10.0-P2.50-L
  round 1.524 hole 0.762: 1(-2.5,0) 2(0,0) 3(2.5,0)
res-adj-th_rk097111080j
  round 1.8 hole 1.2: 1(-2.5,0) 2(0,0) 3(2.5,0)
SOD-123_L2.7-W1.7-LS3.8-RD
  rect 0.91x0.84 smd: 1(-1.655,0) 2(1.655,0)
SOP-8_L5.0-W4.0-P1.27-LS6.0-BL
  oval 0.574x2.035 smd: 1(-1.905,-2.768) 2(-0.635,-2.768) 3(0.635,-2.768) 4(1.905,-2.768) 5(1.905,2.768) 6(0.635,2.768) 7(-0.635,2.768) 8(-1.905,2.768)
TDFN-10_L3.0-W3.0-P0.50-BL-EP
  rect 0.28x0.665 smd: 1(-1,-1.407) 2(-0.5,-1.407) 3(0,-1.407) 4(0.5,-1.407) 5(1,-1.407) 6(1,1.407) 7(0.5,1.407) 8(0,1.407) 9(-0.5,1.407) 10(-1,1.407)
  rect 2.4x1.7 smd: 11(0,0)
USB-C-SMD_TYPE-C-6PIN-2MD-073
  rect 0.55x1.1 smd: 1(-3.2,2.375) 2(-2.4,2.375) 11(2.4,2.375) 12(3.2,2.375)
  rect 0.3x1.1 smd: 3(-1.75,2.375) 4(-1.25,2.375) 5(-0.75,2.375) 6(-0.25,2.375) 7(0.25,2.375) 8(0.75,2.375) 9(1.25,2.375) 10(1.75,2.375)
  oval 1.2x1.8 hole 0.6x1.2: 13(-4.325,-2.375) 14(4.325,-2.375)
  oval 1.1x2 hole 0.6x1.5: 13(-4.325,1.825) 14(4.325,1.825)

## Nets
As in the schematic, except:
GND: C1.1 C5.1 C8.1 CN1.1 DC2.2 DC2.3 NOREF.1 RVS1.1 U1.1 U10.9 U10.11 USB2.1 USB2.12
VCC: C5.2 CN1.2 DC2.1 NOREF#2.1 NOREF#3.1 RA1.2 U1.4 U1.8 U10.1 USB2.2 USB2.11

Pads without a net: CN1 3; R2 1; U10 6 7 10; USB2 3 9 13 14

## Via types
v1: diameter 0.6, hole 0.3, Top Layer to Bottom Layer, 22 vias
v2: diameter 0.61, hole 0.305, Top Layer to Bottom Layer, 5 vias

## Routing (per net, layer and track width the routed paths; a pad name or vN(x,y) marks a point on that pad's centre or on a via; arc(x,y) is an arc through that point)
GND: length 1.7
  Bottom Layer w0.2: v1(22.8,46.7) 22.8,47.2 22.5,47.5 U10.9
  vias: v1(15.2,54.1) v1(15.2,53.4) v1(15.2,52.7) v1(15.2,52) v1(15.9,54.1) v1(15.9,53.4) v1(15.9,52.7) v1(15.9,52) v1(22.8,46) v1(25.6,46.6) v1(25.6,45.9) v1(26.3,46.6) v1(26.3,45.9) v1(27,46.6) v1(27,45.9) v1(27.7,46.6) v1(27.7,45.9) v2(47.19,20.73) v2(48.36,22.13) v2(48.36,20.75)
VCC: length 53
  Top Layer w0.2: v1(19.2,45.9) 17.9,45.9 17,46.8 17,51.23 v1(18.68,52.91)
  Bottom Layer w0.2: v1(19.2,45.9) C5.2 18.1,44.9 17.8,45.2 17.8,46.6 18.2,47 U10.1
  Bottom Layer w0.508: 39.22,16.45 39.22,18.08 40.55,19.41 42.27,19.41 43.03,20.17 U1.4 43.03,25.04 CN1.2 49.81,22.33 49.81,13.29 RA1.2
  Bottom Layer w2.54: NOREF#2.1 37.1,43.1 NOREF#3.1
OUT: length 5.8
  Bottom Layer w0.508: U1.3 41.76,25.29 CN1.4
TRIG: length 19.9
  Top Layer w0.381: v2(40.49,23.6) 40.49,19.21 v2(41.69,18.01)
  Bottom Layer w0.381: U2.1 43.09,11.79 43.09,13.56 ; U1.2 v2(40.49,23.6) ; v2(41.69,18.01) 41.76,17.94 41.76,14.89 43.09,13.56 ; 43.09,13.56 45.51,15.98 R2.2
$1N725: length 6.8
  Bottom Layer w0.2: U10.8 23,48 23.5,47.5 23.5,45.5 22.95,44.95 RVS1.2
$1N735: length 19.4
  Bottom Layer w0.2: U10.4 15.8,48.5 14.2,50.1 14.2,57.4 15.3,58.5 18.1,58.5 18.85,57.75 18.85,56.43
$1N736: length 27.2
  Bottom Layer w0.2: U10.2 15.4,47.5 13.2,49.7 13.2,57.8 14.75,59.35 19.04,59.35 19.89,58.5
  Bottom Layer w0.203: USB2.6 19.85,58.45 19.89,58.5 20.85,57.55 USB2.8
$1N737: length 26
  Bottom Layer w0.203: USB2.5 19.35,58.25 18.67,58.93 15.11,58.93 13.71,57.53 13.71,49.91 15.62,48 U10.3
  Bottom Layer w0.254: USB2.5 19.35,54.94 19.6,54.69 20.14,54.69 20.35,54.89 USB2.7
$1N738: length 14.8
  Top Layer w0.2: 21.77,57.86 21.77,50.87 21.3,50.4 18.2,50.4 17.8,50 v1(17.8,49.4)
  Bottom Layer w0.2: v1(17.8,49.4) 18.2,49 U10.5
  Bottom Layer w0.203: 21.77,56.35 21.8,56.33 21.8,57.86
  vias: v1(21.8,57.86)
$1N1179: length 8.1
  Bottom Layer w0.381: 43.03,16.45 43.85,17.27 43.85,22.65 C1.2
$1N1184: length 12.6
  Bottom Layer w0.381: R1.2 44.11,7.46 U2.2 42.07,9.5 42.07,13.06 40.49,14.63 40.49,16.45
$1N1185: length 3.3
  Bottom Layer w0.381: R1.1 46.64,5.38 RA1.1
$1N1186: length 3
  Bottom Layer w0.381: 39.78,13.56 39.78,12.04 RB1.1
$1N1187: length 4.5
  Bottom Layer w0.381: R1.3 40.8,6.14 RB1.2
$1N1196: length 4.6
  Bottom Layer w0.381: 44.99,22.01 44.99,21.02 R2.3

## Copper pours and planes (outline as drawn; the poured copper is in the pictures)
GND on Top Layer: -5.62,66.01 74.83,66.01 74.83,-13.56 -5.62,-13.56
GND on Bottom Layer: -5.18,68.99 70.15,68.99 70.15,-10.19 -5.18,-10.19
VCC on Bottom Layer: 17.4,56.71 47.37,56.71 47.37,45.37 17.4,45.37
VCC on Bottom Layer: 34.7,44.4 46.35,44.4 46.35,25.47 34.7,25.47

Small or netless copper shapes (teardrops, artwork), in the pictures only: 6 on Top Layer, 44 on Bottom Layer

## Text on the board
Bottom Silkscreen Layer: GND | SW | VCC
Top Silkscreen Layer: OUT | VCC | GND
